# EAGLE design soic-adaptor (EAGLE 5.11)
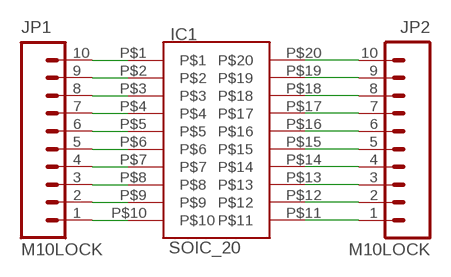
[diagram p0: schematic, sheet 1]

## Parts
IC1  SOIC_20  [SO20W]
JP1  M10LOCK  [1X10_LOCK]
JP2  M10LOCK  [1X10_LOCK]

## Nets
N$1: IC1.P$10 JP1.1
N$2: IC1.P$9 JP1.2
N$3: IC1.P$8 JP1.3
N$4: IC1.P$7 JP1.4
N$5: IC1.P$6 JP1.5
N$6: IC1.P$5 JP1.6
N$7: IC1.P$4 JP1.7
N$8: IC1.P$3 JP1.8
N$9: IC1.P$2 JP1.9
N$10: IC1.P$1 JP1.10
N$11: IC1.P$11 JP2.1
N$12: IC1.P$12 JP2.2
N$13: IC1.P$13 JP2.3
N$14: IC1.P$14 JP2.4
N$15: IC1.P$15 JP2.5
N$16: IC1.P$16 JP2.6
N$17: IC1.P$17 JP2.7
N$18: IC1.P$18 JP2.8
N$19: IC1.P$19 JP2.9
N$20: IC1.P$20 JP2.10

## Library data of the parts
IC1 = SparkFun:SOIC_20
JP1 JP2 = SparkFun:M10: Header 10 Standard 10-pin 0.1" header. Use with straight break away headers (SKU : PRT-00116), right angle break away headers (PRT-00553), swiss pins (PRT-00743), machine pins (PRT-00117), and female headers (PRT-00115).

## Board
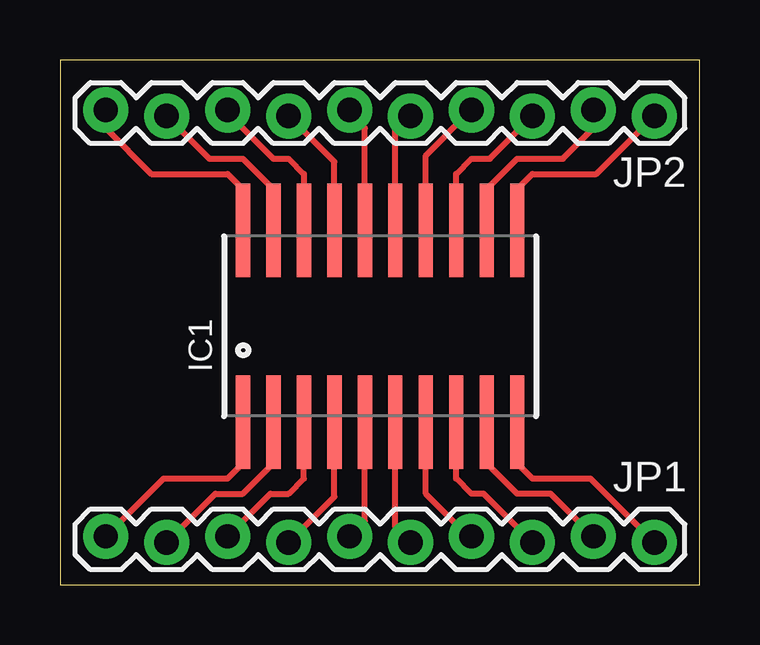
[diagram p1: board, top side]

Size 26.65 x 21.89 mm. Coordinates in mm from the lower left corner, seen from the top.
Outline: 0,0 26.65,0 26.65,21.89 0,21.89 0,0
Copper layers (1*16): Top 0.035mm / dielectric 1.5mm / Bottom 0.035mm
Design rules "cft-olimex-10mil-small-pads-tented-vias": minimum track width 10mil, minimum drill 24mil, track to track 10mil, track to pad 10mil, pad to pad 10mil, via to via 10mil, smd to smd 10mil, copper to edge 40mil, drill to drill 10mil, minimum pad ring 10mil, minimum via ring 12mil, stop-mask expansion 4mil, vias tented up to drill 30mil, thermal gap 10mil

### Footprints (pad centres in the part's own frame; a part is rotated, then mirrored left to right if it is on the bottom)
SO20W = smd 0.6 x 3.9: P$1 -5.715,-4; P$2 -4.445,-4; P$3 -3.175,-4; P$4 -1.905,-4; P$5 -0.635,-4; P$6 0.635,-4; P$7 1.905,-4; P$8 3.175,-4; P$9 4.445,-4; P$10 5.715,-4; P$11 5.715,4; P$12 4.445,4; P$13 3.175,4; P$14 1.905,4; P$15 0.635,4; P$16 -0.635,4; P$17 -1.905,4; P$18 -3.175,4; P$19 -4.445,4; P$20 -5.715,4
1X10_LOCK = drill 1.016 pad 1.88 round: 1 0,0.127; 2 2.54,-0.127; 3 5.08,0.127; 4 7.62,-0.127; 5 10.16,0.127; 6 12.7,-0.127; 7 15.24,0.127; 8 17.78,-0.127; 9 20.32,0.127; 10 22.86,-0.127

### Placement (x,y rotation side)
IC1  13.34,10.79 0 top
JP1  24.77,1.91 180 top
JP2  24.77,19.68 180 top

### Tracks (layer width: path | path; a pad name or v marks a point on that pad's centre or on a via)
N$1
  Top 0.254: IC1.P$10 19.05,5.08 19.68,4.45 22.1,4.45 JP1.1
N$2
  Top 0.254: IC1.P$9 17.78,5.08 19.05,3.81 20.45,3.81 JP1.2
N$3
  Top 0.254: IC1.P$8 16.51,4.45 17.14,3.81 17.65,3.81 JP1.3
N$4
  Top 0.254: IC1.P$7 15.24,3.81 16.51,2.54 16.64,2.54 JP1.4
N$5
  Top 0.254: IC1.P$6 13.97,2.41 JP1.5
N$6
  Top 0.254: IC1.P$5 12.7,2.67 JP1.6
N$7
  Top 0.254: IC1.P$4 11.43,3.68 JP1.7
N$8
  Top 0.254: IC1.P$3 10.16,4.45 9.53,3.81 8.76,3.81 JP1.8
N$9
  Top 0.254: IC1.P$2 8.89,5.08 7.62,3.81 6.48,3.81 JP1.9
N$10
  Top 0.254: IC1.P$1 7.62,5.08 6.99,4.45 4.32,4.45 JP1.10
N$11
  Top 0.254: IC1.P$11 19.05,16.51 19.68,17.14 22.35,17.14 JP2.1
N$12
  Top 0.254: IC1.P$12 17.78,16.51 19.05,17.78 20.95,17.78 22.23,19.05 JP2.2
N$13
  Top 0.254: IC1.P$13 16.51,17.14 17.14,17.78 17.91,17.78 JP2.3
N$14
  Top 0.254: IC1.P$14 15.24,17.91 JP2.4
N$15
  Top 0.254: JP2.5 14.48,19.56 13.97,19.05 IC1.P$15
N$16
  Top 0.254: JP2.6 12.06,19.68 12.7,19.05 IC1.P$16
N$17
  Top 0.254: IC1.P$17 11.43,17.65 JP2.7
N$18
  Top 0.254: IC1.P$18 10.16,17.14 9.53,17.78 8.89,17.78 6.99,19.68 JP2.8
N$19
  Top 0.254: IC1.P$19 8.89,16.51 7.62,17.78 6.22,17.78 JP2.9
N$20
  Top 0.254: IC1.P$20 7.62,16.51 6.99,17.14 3.81,17.14 1.91,19.05 JP2.10